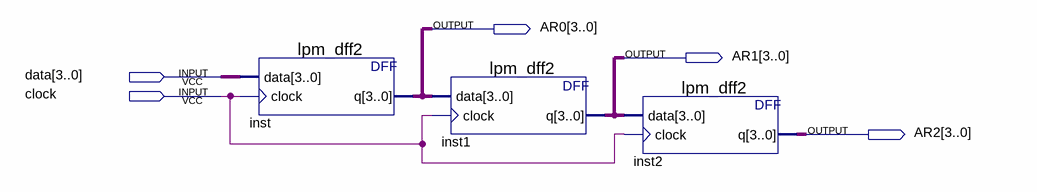
[diagram p0: schematic sheet]
// Quartus schematic AR.bdf as structural Verilog: 3 symbols, 5 pins
module AR (
  input  [3:0] data,
  input  clock,
  output [3:0] AR0,
  output [3:0] AR1,
  output [3:0] AR2
);

  lpm_dff2 inst (.data(data), .clock(clock), .q(AR0));
  lpm_dff2 inst1 (.data(AR0), .clock(clock), .q(AR1));
  lpm_dff2 inst2 (.data(AR1), .clock(clock), .q(AR2));
endmodule
